# EAGLE design SMD_cree_driver_led-mosfet001 (EAGLE 6.2)
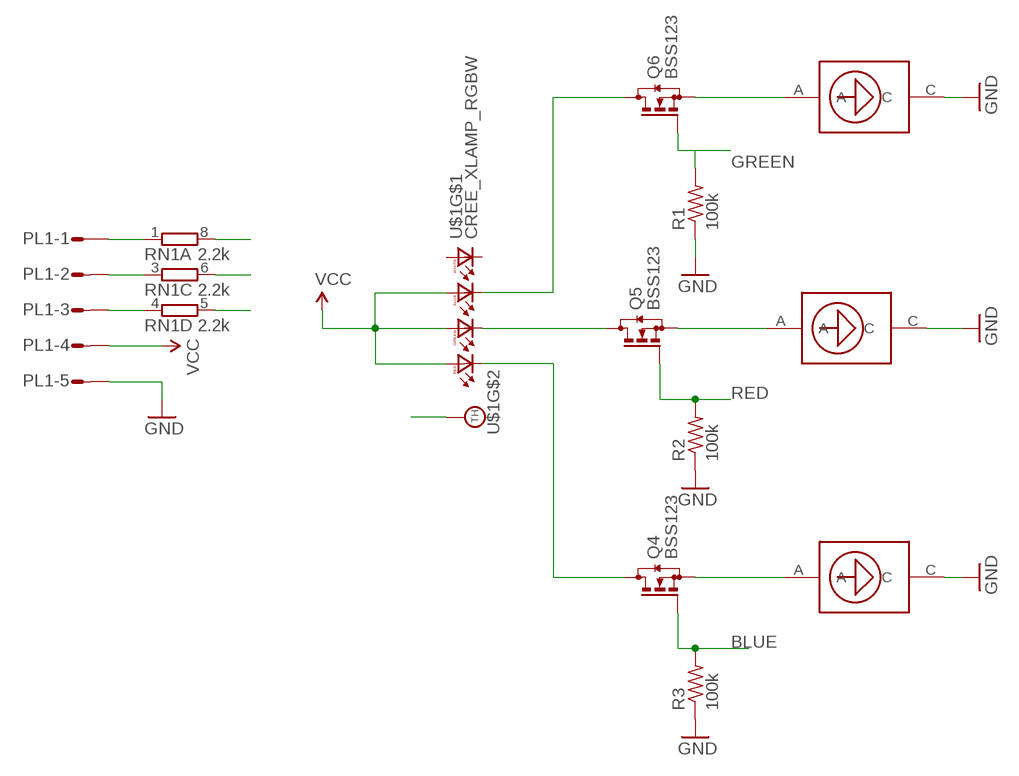
[diagram p0: schematic, sheet 1]

## Parts
PL1  DF3-05R  [DF3R-05]
Q4  BSS123  [SOT23]
Q5  BSS123  [SOT23]
Q6  BSS123  [SOT23]
R1  100k  R-US_R0402  [R0402]
R2  100k  R-US_R0402  [R0402]
R3  100k  R-US_R0402  [R0402]
RN1  2.2k  4R-N0603-ARC  [0603-ARC]
U$1  CREE_XLAMP_RGBW  [CREE_XLAMP_XML]
U$2  NSI50350AST3G  [SMC-2]
U$3  NSI50350AST3G  [SMC-2]
U$4  NSI50350AST3G  [SMC-2]

## Nets
BLUE [sig]: Q4.1(G) R3.2 RN1.5
BLUE_OUT [sig]: PL1.3 RN1.4
GND: PL1.5 R1.1 R2.1 R3.1 U$2.C U$3.C U$4.C
GREEN [sig]: Q6.1(G) R1.2 RN1.8
GREEN_OUT [sig]: PL1.1 RN1.1
N$1: Q6.3(D) U$1.6(BC)
N$2: Q5.3(D) U$1.7(GC)
N$3: Q4.3(D) U$1.8(RC)
N$4: Q6.2(S) U$2.A
N$6: Q4.2(S) U$4.A
N$7: Q5.2(S) U$3.A
RED [sig]: Q5.1(G) R2.2 RN1.6
RED_OUT [sig]: PL1.2 RN1.3
THERM: U$1.P$1(TH)
VCC: PL1.4 U$1.1(RA) U$1.2(GA) U$1.3(BA)
Unconnected: RN1.2 RN1.7 U$1.4(WA) U$1.5(WC)

## Library data of the parts
PL1 = con-hirose-df3:DF3-05: Single row connector 2mm 5 way
Q4-Q6 = transistor-small-signal:BSS123: N-CHANNEL MOS FET
R1-R3 = resistor:R-US_: RESISTOR, American symbol
RN1 = resistor-dil:4R-N: Array Chip Resistor Source: RS Component / Phycomp; OC_FARNELL: unknown; OC_NEWARK: unknown
U$1 = led:CREE_XLAMP_RGBW: Cree XLAMP XM-L Color RGBW led http://www.mouser.com/ds/2/90/XLampXML_Color-218132.pdf
U$2-U$4 = on-semiconductor:NSI50350AST3G

## Net classes
0 default: width 0.813 mm
1 sig: width 0.305 mm

## Board
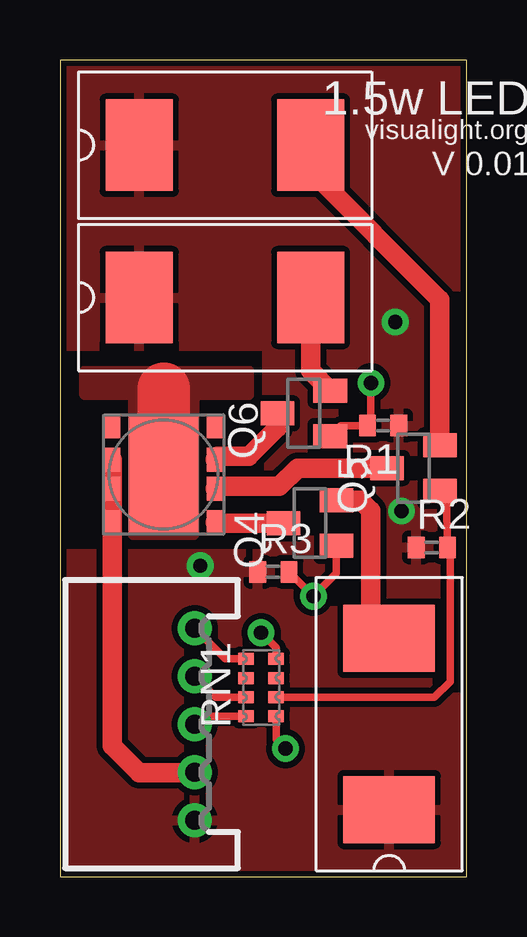
[diagram p1: board, top side]
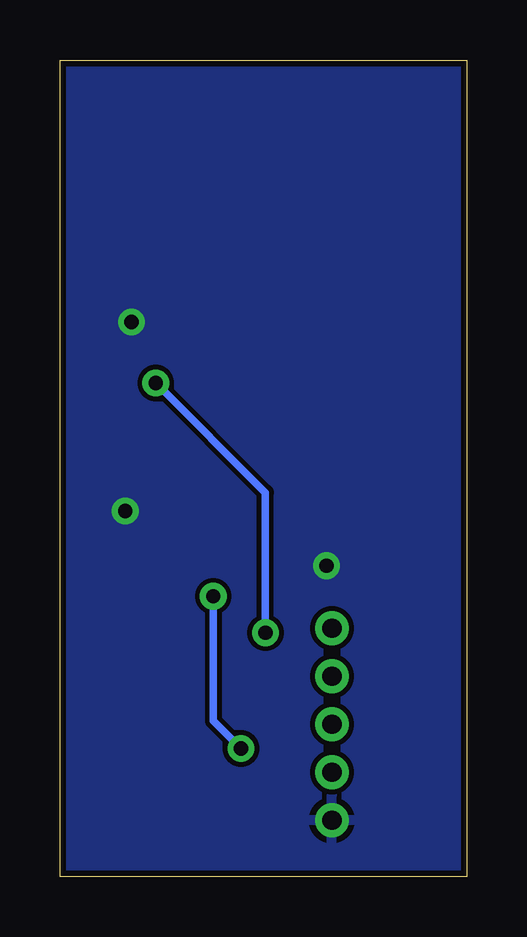
[diagram p2: board, bottom side, seen from below]

Size 16.94 x 34.03 mm. Coordinates in mm from the lower left corner, seen from the top.
Outline: 0,0 16.94,0 16.94,34.03 0,34.03 0,0
Copper layers (1*16): Top 0.035mm / dielectric 1.5mm / Bottom 0.035mm
Design rules: minimum track width 8mil, minimum drill 20mil, track to track 8mil, track to pad 8mil, pad to pad 8mil, via to via 8mil, smd to smd 8mil, copper to edge 10mil, drill to drill 8mil, minimum pad ring 12mil, minimum via ring 10mil, stop-mask expansion 4mil, vias tented up to drill 25mil, thermal gap 10mil

### Footprints (pad centres in the part's own frame; a part is rotated, then mirrored left to right if it is on the bottom)
DF3R-05 = drill 0.8: 1 -4,1.8; 2 -2,1.8; 3 0,1.8; 4 2,1.8; 5 4,1.8
SOT23 = smd 1 x 1.4: 1 -0.95,-1.1; 2 0.95,-1.1; 3 0,1.1
R0402 = smd 0.7 x 0.9: 1 -0.65,0; 2 0.65,0
0603-ARC = smd 0.5 x 0.65: 1 -1.2,-0.625; 2 -0.4,-0.625; 3 0.4,-0.625; 4 1.2,-0.625; 5 1.2,0.625; 6 0.4,0.625; 7 -0.4,0.625; 8 -1.2,0.625
CREE_XLAMP_XML = smd 0.7 x 1: 1 2.15,2; 2 2.15,0.6; 3 2.15,-0.6; 4 2.15,-2; 5 -2.15,-2; 6 -2.15,-0.6; 7 -2.15,0.6; 8 -2.15,2 | smd 2.9 x 5: P$1 0,0
SMC-2 = smd 2.794 x 3.81: A 7.137,0; C 0,0

### Placement (x,y rotation side)
PL1  3.81,6.35 270 top
Q4  10.41,14.73 90 top
Q5  14.73,17.02 90 top
Q6  10.16,19.3 90 top
R1  13.46,18.8 180 top
R2  15.49,13.72 0 top
R3  8.89,12.7 0 top
RN1  8.38,7.87 270 top
U$1  4.32,16.76 180 top
U$2  3.3,24.13 0 top
U$3  3.3,30.48 0 top
U$4  13.72,2.79 90 top

### Tracks (layer width: path | path; a pad name or v marks a point on that pad's centre or on a via)
BLUE  (via drill 0.6)
  Top 0.305: RN1.5 9.01,5.72 v9.4,5.33 | R3.2 v10.56,11.68 | v10.56,11.68 10.67,11.68 | Q4.1 11.51,12.64 v10.56,11.68
  Bottom 0.305: v10.56,11.68 10.56,6.49 v9.4,5.33
BLUE_OUT
  Top 0.305: RN1.4 5.93,6.67 PL1.3
GND  (via drill 0.6)
  other vias: 14.22,15.24 5.84,12.95 13.97,23.11
  pour Bottom: 0,34.04 20.57,34.04 20.57,0 0,0
  pour Top (isolate 0.254): -1.52,34.04 20.57,34.04 20.57,0 0,0 -0.51,11.94 -0.51,13.46 8.64,13.46 8.64,22.1 -1.52,22.1
GREEN  (via drill 0.6)
  Top 0.305: RN1.8 9.01,9.54 v8.38,10.16 | v12.95,20.57 12.95,18.94 R1.2 11.7,18.8 Q6.1
  Bottom 0.305: v8.38,10.16 8.38,16 v12.95,20.57
GREEN_OUT
  Top 0.305: RN1.1 6.89,9.07 PL1.1
N$1
  Top 0.813: 6.56,17.53 6.6,17.53 | 6.6,17.53 7.87,17.53 9.06,18.71 Q6.3 | U$1.6 6.47,17.39 6.6,17.53
N$2
  Top 0.813: Q5.3 9.91,17.02 9.14,16.26 6.56,16.26 U$1.7
N$3
  Top 0.813: Q4.3 7.11,14.73 6.75,14.73 6.5,14.73 U$1.8
N$4
  Top 0.813: U$2.A 10.44,21.07 Q6.2
N$6
  Top 0.813: Q4.2 12.51,15.68 12.95,15.24 12.95,10.18 U$4.A
N$7
  Top 0.813: Q5.2 15.83,24.05 10.41,29.46 10.41,30.48 U$3.A
RED
  Top 0.305: Q5.1 16.11,15.79 R2.2 16.26,13.6 16.26,8.13 15.6,7.47 RN1.6
RED_OUT
  Top 0.305: RN1.3 6.49,7.47 PL1.2
THERM
  Top 2.184: 4.32,20.32 U$1.P$1
  pour Top (no thermals): 1.02,21.08 7.87,21.08 7.87,20.07 5.59,20.07 5.59,14.22 3.05,14.22 3.05,20.07 1.02,20.07
VCC
  Top 0.813: PL1.4 5.58,4.32 3.3,4.32 2.17,5.45 U$1.1 U$1.2 U$1.3

### Text on the board
tNames: 1.5w LED | visualight.org | V 0.01